# Altium schematic sheet V0.1.SchDoc
size A3
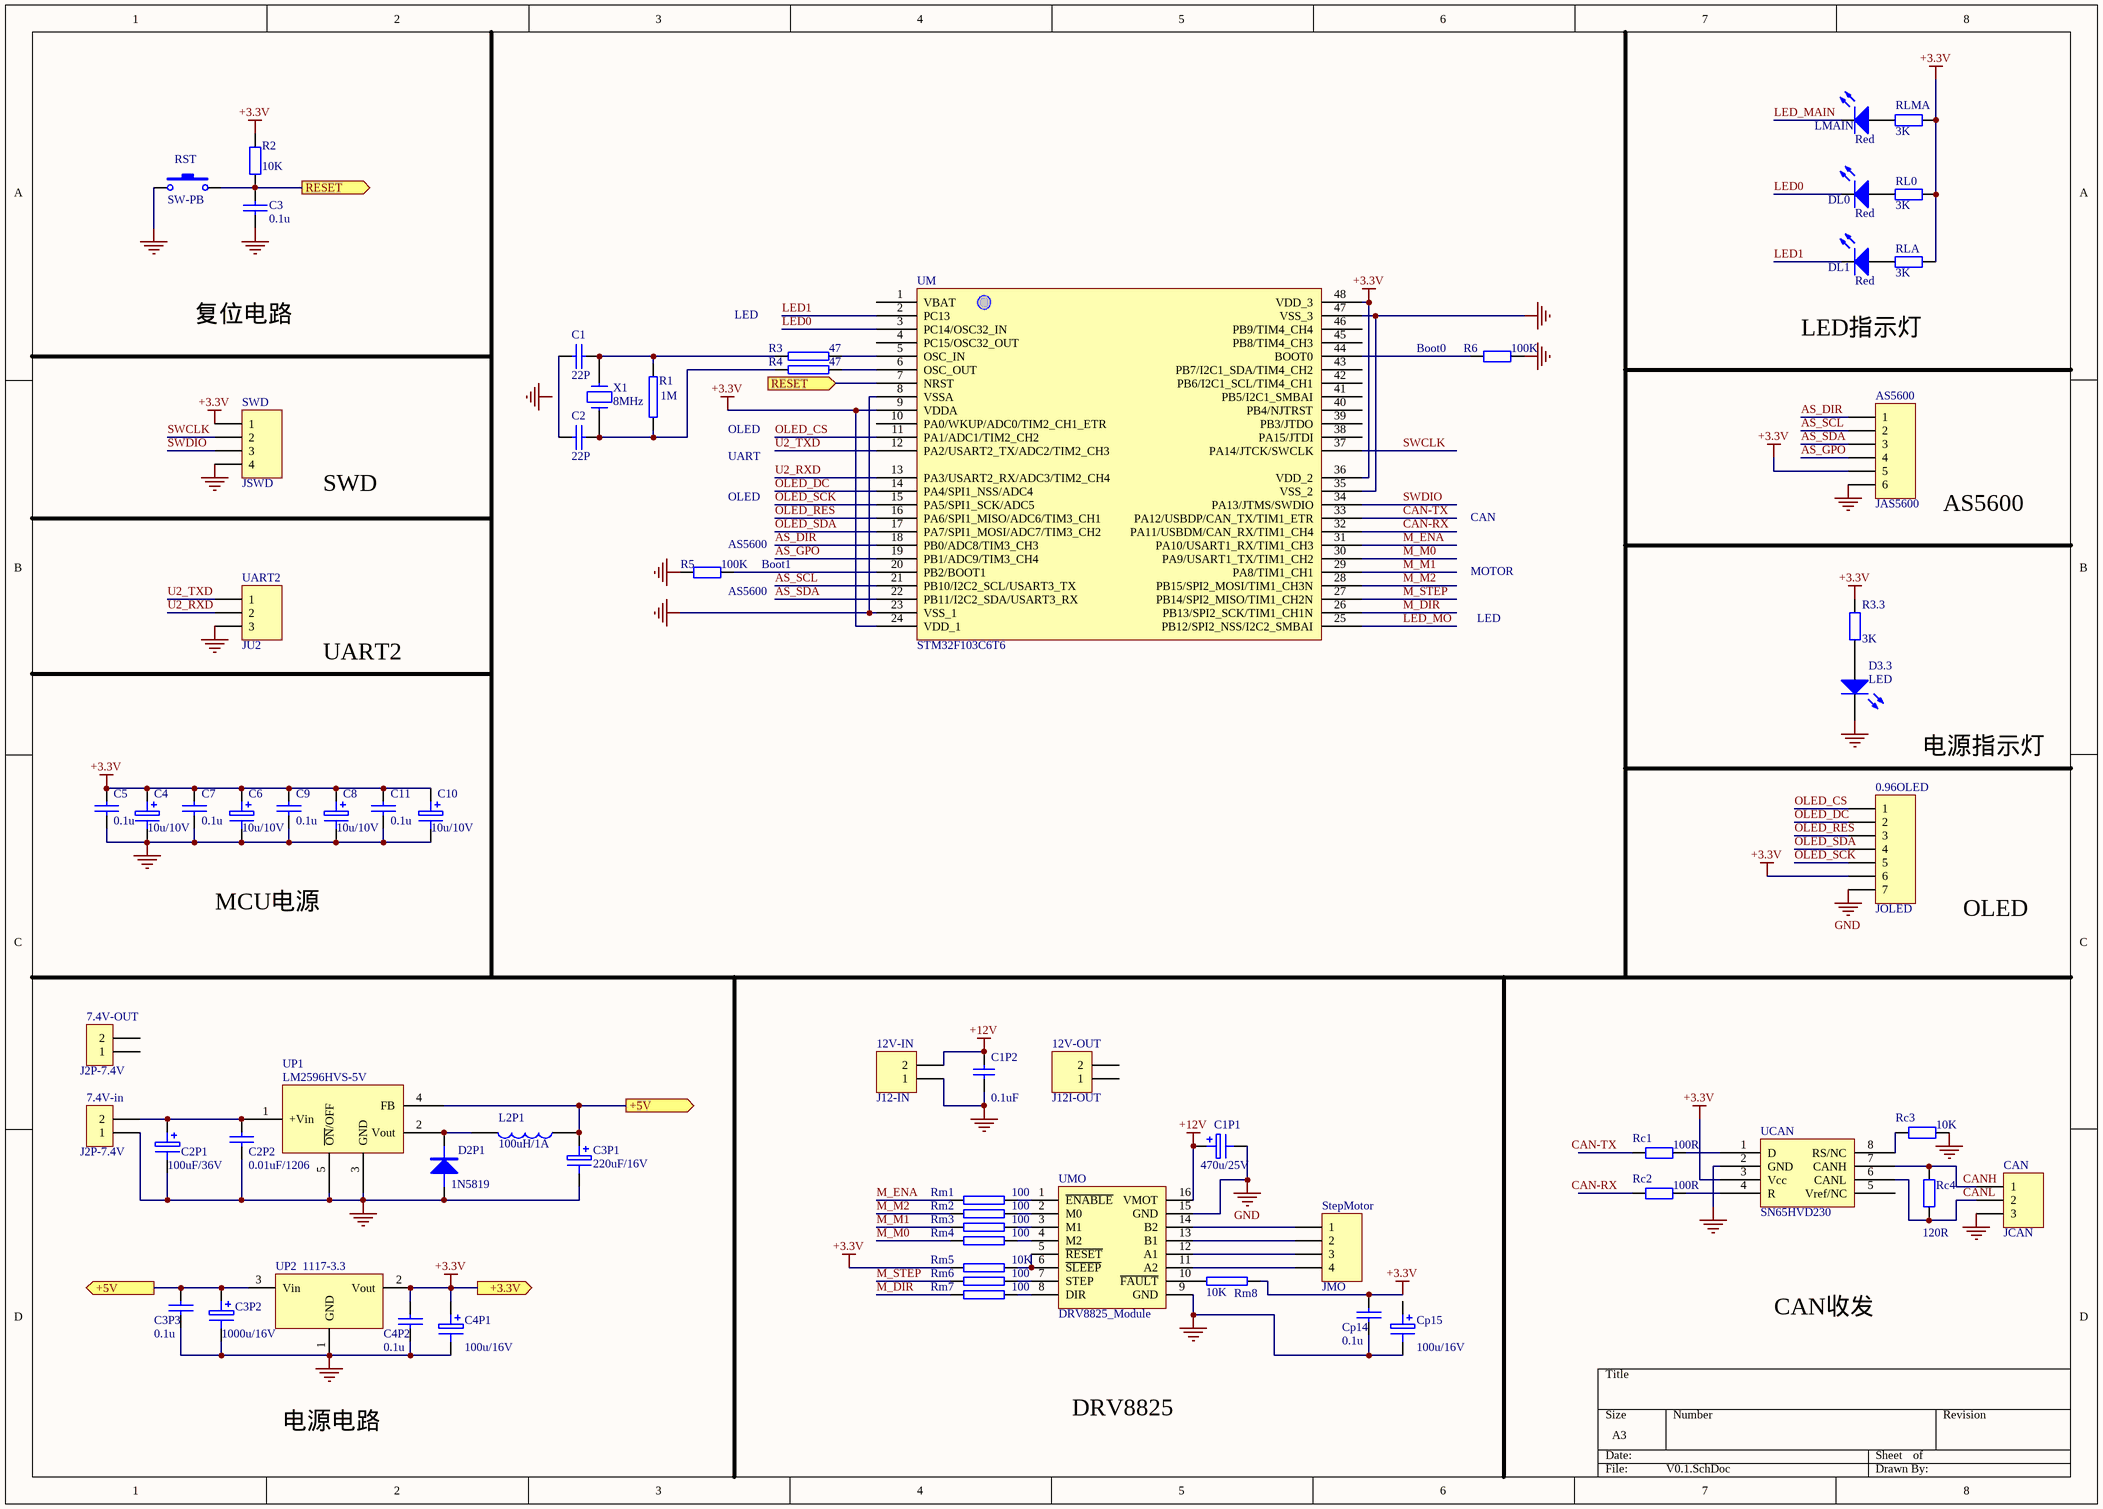
[diagram p0: V0.1.SchDoc]

## Parts
0.96OLED  JOLED  [HDR1X7]
7.4V-in  J2P-7.4V
7.4V-OUT  J2P-7.4V
12V-IN  J12-IN  [HDR1X2]
12V-OUT  J12I-OUT  [HDR1X2]
AS5600  JAS5600  [HDR1X6]
C1  22P
C1P1  470u/25V
C1P2  value 0.1uF  [C1206]  (hidden comment: Cap Semi)
C2  22P
C2P1  100uF/36V
C2P2  0.01uF/1206
C3  0.1u
C3P1  220uF/16V
C3P2  1000u/16V
C3P3  0.1u
C4  10u/10V
C4P1  100u/16V
C4P2  0.1u
C5  0.1u
C6  10u/10V
C7  0.1u
C8  10u/10V
C9  0.1u
C10  10u/10V
C11  0.1u
CAN  JCAN  [HDR1X3]
Cp14  0.1u
Cp15  100u/16V
D2P1  1N5819
D3.3  LED  [3.2X1.6X1.1]
DL0  Red  [LED-0]
DL1  Red  [LED-0]
L2P1  100uH/1A
LMAIN  Red  [LED-0]
R1  1M
R2  10K  [AXIAL-0.4]
R3  47
R3.3  value 3K  [AXIAL-0.4]  (hidden comment: Res2)
R4  47
R5  value 100K  [AXIAL-0.4]  (hidden comment: Res2)
R6  value 100K  [AXIAL-0.4]  (hidden comment: Res2)
Rc1  value 100R  [AXIAL-0.4]  (hidden comment: Res2)
Rc2  value 100R  [AXIAL-0.4]  (hidden comment: Res2)
Rc3  value 10K  [AXIAL-0.4]  (hidden comment: Res2)
Rc4  value 120R  [AXIAL-0.4]  (hidden comment: Res2)
RL0  value 3K  [AXIAL-0.4]  (hidden comment: Res2)
RLA  value 3K  [AXIAL-0.4]  (hidden comment: Res2)
RLMA  value 3K  [AXIAL-0.4]  (hidden comment: Res2)
Rm1  100
Rm2  100
Rm3  100
Rm4  100
Rm5  10K
Rm6  100
Rm7  100
Rm8  10K
RST  SW-PB  [SPST-2]
StepMotor  JMO  [HDR1X4]
SWD  JSWD  [HDR1X4]
UART2  JU2  [HDR1X3]
UCAN  SN65HVD230
UM  STM32F103C6T6
UMO  DRV8825_Module
UP1  LM2596HVS-5V
UP2  1117-3.3
X1  8MHz

## Ports
+3.3V, +5V (out), RESET (in), RESET (out)

## Nets
+3.3V: 0.96OLED.6 AS5600.5 C4.1 C4P1.1 C4P2.1 C5.2 C6.1 C7.1 C8.1 C9.1 C10.1 C11.1 Cp14.1 R2.2 R3.3.2 RL0.1 RLA.1 RLMA.1 Rm5.1 Rm8.1 SWD.1 UCAN.3(Vcc) UM.9(VDDA) UM.24(VDD_1) UM.36(VDD_2) UM.48(VDD_3) UP2.2(Vout) ; port +3.3V
+12V: 12V-IN.2 C1P1.1 C1P2.2 UMO.16(VMOT)
GND: 0.96OLED.7 12V-IN.1 AS5600.6 C1P1.2 C1P2.1 C3.1 C3P2.2 C3P3.2 C4.2 C4P1.2 C4P2.2 C5.1 C6.2 C7.2 C8.2 C9.2 C10.2 C11.2 CAN.3 D3.3.2(K) R5.1 R6.2 Rc3.1 SWD.4 UART2.3 UCAN.2(GND) UM.8(VSSA) UM.23(VSS_1) UM.35(VSS_2) UM.47(VSS_3) UMO.15(GND) UP2.1(GND)
NetCp14_2: Cp14.2 Cp15.2 RST.1 UMO.9(GND)
VCC: 7.4V-in.1 C2P1.2 C2P2.2 C3P1.2 D2P1.1(A) UP1.3(GND) UP1.5(~{ON}/OFF)
+5V: C3P1.1 C3P2.1 C3P3.1 L2P1.1 UP1.4(FB) UP2.3(Vin) ; port +5V
AS_DIR: AS5600.1 UM.18(PB0/ADC8/TIM3_CH3)
AS_GPO: AS5600.4 UM.19(PB1/ADC9/TIM3_CH4)
AS_SCL: AS5600.2 UM.21(PB10/I2C2_SCL/USART3_TX)
AS_SDA: AS5600.3 UM.22(PB11/I2C2_SDA/USART3_RX)
CAN-RX: UM.32(PA11/USBDM/CAN_RX/TIM1_CH4)
CAN-TX: UM.33(PA12/USBDP/CAN_TX/TIM1_ETR)
CANH: CAN.1 Rc4.2 UCAN.7(CANH)
CANL: CAN.2 Rc4.1 UCAN.6(CANL)
LED0: DL0.2(K) UM.3(PC14/OSC32_IN)
LED1: DL1.2(K) UM.2(PC13)
LED_MAIN: LMAIN.2(K)
LED_MO: UM.25(PB12/SPI2_NSS/I2C2_SMBAI)
M_DIR: Rm7.1 UM.26(PB13/SPI2_SCK/TIM1_CH1N)
M_ENA: Rm1.1 UM.31(PA10/USART1_RX/TIM1_CH3)
M_M0: Rm4.1 UM.30(PA9/USART1_TX/TIM1_CH2)
M_M1: Rm3.1 UM.29(PA8/TIM1_CH1)
M_M2: Rm2.1 UM.28(PB15/SPI2_MOSI/TIM1_CH3N)
M_STEP: Rm6.1 UM.27(PB14/SPI2_MISO/TIM1_CH2N)
OLED_CS: 0.96OLED.1 UM.11(PA1/ADC1/TIM2_CH2)
OLED_DC: 0.96OLED.2 UM.14(PA4/SPI1_NSS/ADC4)
OLED_RES: 0.96OLED.3 UM.16(PA6/SPI1_MISO/ADC6/TIM3_CH1)
OLED_SCK: 0.96OLED.5 UM.15(PA5/SPI1_SCK/ADC5)
OLED_SDA: 0.96OLED.4 UM.17(PA7/SPI1_MOSI/ADC7/TIM3_CH2)
RESET: C3.2 R2.1 RST.2 UM.7(NRST) ; port RESET
SWCLK: SWD.2 UM.37(PA14/JTCK/SWCLK)
SWDIO: SWD.3 UM.34(PA13/JTMS/SWDIO)
U2_RXD: UART2.2 UM.13(PA3/USART2_RX/ADC3/TIM2_CH4)
U2_TXD: UART2.1 UM.12(PA2/USART2_TX/ADC2/TIM2_CH3)
Net7.4V-in_2: 7.4V-in.2 C2P1.1 C2P2.1 UP1.1(+Vin)
NetC1_1: C1.1 R1.1 R3.2 X1.2
NetC1_2: C1.2 C2.2
NetC2_1: C2.1 R1.2 R4.2 X1.1
NetD2P1_2: D2P1.2(K) L2P1.2 UP1.2(Vout)
NetD3.3_1: D3.3.1(A) R3.3.1
NetDL0_1: DL0.1(A) RL0.2
NetDL1_1: DL1.1(A) RLA.2
NetLMAIN_1: LMAIN.1(A) RLMA.2
NetR3_1: R3.1 UM.5(OSC_IN)
NetR4_1: R4.1 UM.6(OSC_OUT)
NetR5_2: R5.2 UM.20(PB2/BOOT1)
NetR6_1: R6.1 UM.44(BOOT0)
NetRc1_1: Rc1.1 UCAN.1(D)
NetRc2_1: Rc2.1 UCAN.4(R)
NetRc3_2: Rc3.2 UCAN.8(RS/NC)
NetRm1_2: Rm1.2 UMO.1(~{ENABLE})
NetRm2_2: Rm2.2 UMO.2(M0)
NetRm3_2: Rm3.2 UMO.3(M1)
NetRm4_2: Rm4.2 UMO.4(M2)
NetRm5_2: Rm5.2 UMO.5(~{RESET}) UMO.6(~{SLEEP})
NetRm6_2: Rm6.2 UMO.7(STEP)
NetRm7_2: Rm7.2 UMO.8(DIR)
NetRm8_2: Rm8.2 UMO.10(~{FAULT})
NetStepMotor_1: StepMotor.1 UMO.14(B2)
NetStepMotor_2: StepMotor.2 UMO.13(B1)
NetStepMotor_3: StepMotor.3 UMO.12(A1)
NetStepMotor_4: StepMotor.4 UMO.11(A2)

Not connected (* = marked no-connect by the designer): 7.4V-OUT 1 2; 12V-OUT 1 2; Cp15 1; Rc1 2; Rc2 2; UCAN 5(Vref/NC); UM 1(VBAT) 4(PC15/OSC32_OUT) 10(PA0/WKUP/ADC0/TIM2_CH1_ETR) 38(PA15/JTDI) 39(PB3/JTDO) 40(PB4/NJTRST) 41(PB5/I2C1_SMBAI) 42(PB6/I2C1_SCL/TIM4_CH1) 43(PB7/I2C1_SDA/TIM4_CH2) 45(PB8/TIM4_CH3) 46(PB9/TIM4_CH4)

## Notes on the sheet
- LED
- 复位电路
- (near R6) Boot0
- LED指示灯
- OLED
- SWD
- UART
- AS5600
- (near R5) AS5600
- (near R5) Boot1
- CAN
- MOTOR
- UART2
- 电源指示灯
- MCU电源
- CAN收发
- 电源电路
- DRV8825
- Labels drawn without touching a wire or pin: CAN-RX, CAN-TX, GND

## Library data of the parts
0.96OLED = Header 7: Header, 7-Pin; LatestRevisionDate: 17-Jul-2002; LatestRevisionNote: Re-released for DXP Platform.; Publisher: Altium Limited
7.4V-in 7.4V-OUT = CON2: Connector
12V-IN 12V-OUT = Header 2: Header, 2-Pin; LatestRevisionDate: 17-Jul-2002; LatestRevisionNote: Re-released for DXP Platform.; Publisher: Altium Limited
AS5600 = Header 6: Header, 6-Pin; LatestRevisionDate: 17-Jul-2002; LatestRevisionNote: Re-released for DXP Platform.; Publisher: Altium Limited
C1 C2 C2P2 C3 C3P3 C4P2 C5 C7 C9 C11 Cp14 = CAP: Capacitor
C1P1 C2P1 C3P1 C3P2 C4 C4P1 C6 C8 C10 Cp15 = ELECTRO1: Electrolytic Capacitor
C1P2 = Cap Semi: Capacitor (Semiconductor SIM Model); Published: 8-Jun-2000; LatestRevisionDate: 29-May-2009; LatestRevisionNote: IPC-7351 Footprint Added.; PackageReference: C1206; Publisher: Altium Limited; PackageDescription: Chip Capacitor
CAN UART2 = Header 3: Header, 3-Pin; LatestRevisionDate: 17-Jul-2002; LatestRevisionNote: Re-released for DXP Platform.; Publisher: Altium Limited
D2P1 = DIODE
D3.3 = LED2: Typical RED, GREEN, YELLOW, AMBER GaAs LED; Published: 8-Jun-2000; LatestRevisionDate: 17-Jul-2002; LatestRevisionNote: Re-released for DXP Platform.; PackageVersion: Feb-2002; PackageReference: 3.2X1.6X1.1; Publisher: Altium Limited; PackageDescription: SM LED; 2 Flat Leads
DL0 DL1 LMAIN = LED0: Typical INFRARED GaAs LED; Published: 8-Jun-2000; LatestRevisionDate: 08-Jul-2005; LatestRevisionNote: Mech Layer 1 removed.; PackageReference: LED-0; Publisher: Altium Limited
L2P1 = INDUCTOR1
R1 R3 R4 Rm1-Rm8 = RES2
R2 R3.3 R5 R6 Rc1-Rc4 RL0 RLA RLMA = Res2: Resistor; Published: 8-Jun-2000; LatestRevisionDate: 17-Jul-2002; LatestRevisionNote: Re-released for DXP Platform.; PackageReference: AXIAL-0.4; Publisher: Altium Limited
  R2: PackageDescription: Axial Device, Thru-Hole; 2 Leads; 0.4 in Pin Spacing; Value: 10K
  R3.3 R5 R6 Rc1-Rc4: PackageDescription: Axial Device, Thru-Hole; 2 Leads; 0.4 in Pin Spacing
RST = SW-PB: Switch; Published: 24-Mar-1999; LatestRevisionDate: 17-Jul-2002; LatestRevisionNote: Re-released for DXP Platform.; PackageReference: SPST-2; Publisher: Altium Limited
StepMotor SWD = Header 4: Header, 4-Pin; LatestRevisionDate: 17-Jul-2002; LatestRevisionNote: Re-released for DXP Platform.; Publisher: Altium Limited
UM = STM32F103C8T6
X1 = CRYSTAL